# Altium project SteeringWheelSTM32F4.PrjPcb
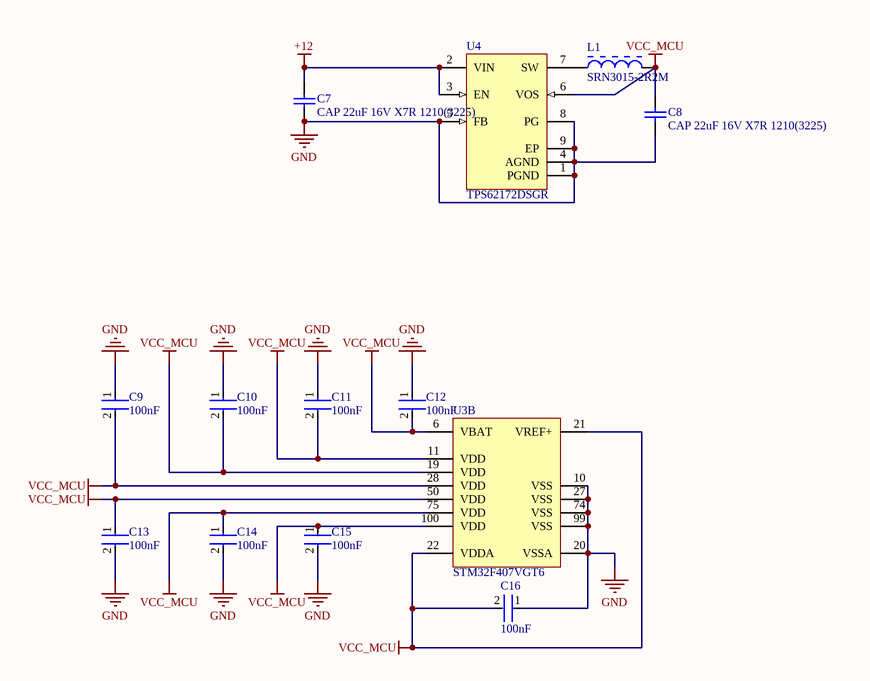
[diagram p0: Power_Supply.SchDoc]
5 sheets, 36 parts. Net scope: flat (ports and power ports of the same name join across sheets).
Board file: SteeringWheelSTM32F4.PcbDoc
Sheets:
  Power_Supply.SchDoc
  Connector.SchDoc
  MCU.SchDoc
  Communications.SchDoc
  User_LEDs.SchDoc

## Sheet Power_Supply.SchDoc
size Letter; Organization: Altium Limited; Address1: L3, 12a Rodborough Rd; Address2: Frenchs Forest; Address3: NSW; Address4: Australia 2086

### Parts
C7  CAP 22uF 16V X7R 1210(3225)  [CAPC1210(3225)280_L]
C8  CAP 22uF 16V X7R 1210(3225)  [CAPC1210(3225)280_L]
C9  100nF  [Kemet_C0603_IPC_A]
C10  100nF  [Kemet_C0603_IPC_A]
C11  100nF  [Kemet_C0603_IPC_A]
C12  100nF  [Kemet_C0603_IPC_A]
C13  100nF  [Kemet_C0603_IPC_A]
C14  100nF  [Kemet_C0603_IPC_A]
C15  100nF  [Kemet_C0603_IPC_A]
C16  100nF  [Kemet_C0603_IPC_A]
L1  SRN3015-2R2M  [BOUR-SRN3015-2_V]
U3  STM32F407VGT6  [STM-LQFP100_M]  (part B of 2)
U4  TPS62172DSGR  [DSG8-1600X900TP]

### Nets
+12: C7.2 U4.2(VIN) U4.3(EN)
GND: C7.1 C8.1 C9.1 C10.1 C11.1 C12.1 C13.2 C14.2 C15.2 C16.1 U3.10(VSS) U3.20(VSSA) U3.27(VSS) U3.74(VSS) U3.99(VSS) U4.1(PGND) U4.4(AGND) U4.5(FB) U4.8(PG) U4.9(EP)
VCC_MCU: C8.2 C9.2 C10.2 C11.2 C12.2 C13.1 C14.1 C15.1 C16.2 L1.2 U3.6(VBAT) U3.11(VDD) U3.19(VDD) U3.21(VREF+) U3.22(VDDA) U3.28(VDD) U3.50(VDD) U3.75(VDD) U3.100(VDD) U4.6(VOS)
NetL1_1: L1.1 U4.7(SW)

### Notes on the sheet
- Title
- Size:
- Date:
- Letter
- Number:
- Time:
- Revision:
- Sheet
- of
- File:

### Library data of the parts
C7 C8 = CMP-1038-02277-1: CAP 22uF 16V ±10% 1210 (3225 Metric) Thickness 2.8mm SMD; Case-Metric: 3225; Case-EIA: 1210; Tolerance: Â±10%; Rated Voltage: 16 V; Technology: SMT; Value: 22uF; Max Thickness: 2.8 mm
C9-C16 = C0603C104K5RACTU: CAP CER 0.1UF 100NF 50V X7R 0603 C0603C104K5RACTU
L1 = CMP-0007-00003-1: Semi-shielded Power Inductor, 2.2 uH, +/- 20%, 1.8 A, -40 to 125 degC, 3 x 3 x 1.5 mm SMD, RoHS and Halogen Free, Tape and Reel; Manufacturer: Bourns; Isat: 1.65 A; Rated current: 1.8 A; Inductance: 2.2 uH; Inductance tolerance: +/- 20%; DCR Max: 0.072 Ohm; SRF Min: 90 MHz; Resistance to Solder Heat: +260 degC for 10 sec.; Operating Temperature: -40 to 125 degC; PartNumber: SRN3015-2R2M; Packing: Tape and Reel; ComponentLink3Description: Package Specification; ComponentLink2Description: Datasheet; RoHS: TRUE; ComponentLink3URL: http://www.bourns.com/data/global/pdfs/SRN3015.pdf; PackageDescription: 2-Pin SMD, Body 3 x 3 mm, Height 1.5 mm; ComponentLink1URL: http://www.bourns.com/; ComponentLink1Description: Manufacturer URL; DatasheetVersion: Aug-11; Mounting Technology: Surface Mount; ComponentLink2URL: http://www.bourns.com/data/global/pdfs/SRN3015.pdf; PackageReference: SRN3015
U3 = CMP-0243-00017-3: ARM Cortex-M4 32-bit MCU+FPU, 210 DMIPS, 1024 kB Flash, 192 kB Internal RAM, 82 I/Os, 100-pin LQFP, -40 to 85 degC, Tray; Manufacturer: STMicroelectronics; Supply Voltage(Vcc) min (V): 1.8; Supply Voltage(Vcc) max (V): 3.6; I/Os (High Current): 82; Operating Frequency(F) (Processor speed) (MHz): 168; D/A Converter: 2x12-bit; FLASH Size (Prog) (kB): 1024; Internal RAM Size (kB): 192; PackageDescription: 100-Pin Low Profile Quad Flat Package, 14 x 14 mm Body, 0.5 mm Pitch; ComponentLink3URL: http://www.st.com/st-web-ui/static/active/en/resource/technical/document/data_brief/DM00071938.pdf; PackageVersion: Rev. 1, 06/2013; PackageReference: LQFP100; PartNumber: STM32F407VGT6; ComponentLink1Description: Manufacturer URL; ComponentLink2URL: http://www.st.com/st-web-ui/static/active/en/resource/technical/document/datasheet/DM00037051.pdf; DatasheetVersion: Rev. 4; ComponentLink3Description: Package Specification; Core: ARM Cortex-M4; ComponentLink2Description: Datasheet; Mounting Technology: Surface Mount; ComponentLink1URL: http://www.st.com/web/en/home.html; Packing: Tray
U4 = TPS62172DSGR: Buck Step Down Regulator with 3 to 17 V Input and 3.3 V Output, -40 to 85 degC, 8-Pin WSON (DSG), Green (RoHS & no Sb/Br); Manufacturer: Texas Instruments; Vout(Min)(V): 3.3; Vin(Min)(V): 3; Duty Cycle(Max)(%): 100; SubFamily: Step-Down Regulator; Iq(Typ)(mA): 0.017; Vin(Max)(V): 17; Synchronous Rectification: TRUE; Regulated Outputs(#): 1; Rating: Catalog; Switch Current Limit(Typ)(A): 1.05; Iout(Max)(A): 0.5; Vout(Max)(V): 3.3; Preset Vout(V): 3.3; Topology: Buck; Eco-Plan: Green (RoHS & no Sb/Br); PartNumber: TPS62172DSGR; ComponentLink1Description: Datasheet; ComponentLink2Description: Package Specification; DatasheetVersion: SLVSAT8A; ComponentLink3URL: Samples URL:http://www.ti.com/product/tps62172#samples; ComponentLink1URL: http://www.ti.com/general/docs/lit/getliterature.tsp?genericPartNumber=TPS62172&fileType=pdf; Code_JEDEC: MO-229; ComponentLink2URL: http://www.ti.com/litv/pdf/mpds308a; ComponentLink3Description: URL Link1; PackageVersion: revB, Oct-2010; Mounting Technology: Surface Mount; PackageReference: DSG8-1600X900TP; PackageDescription: 8-Pin Plastic Small Outline No-Lead, 2 x 2 x 0.8 mm Body, 0.5 mm Pitch, Exposed Pad

## Sheet Connector.SchDoc
size A4
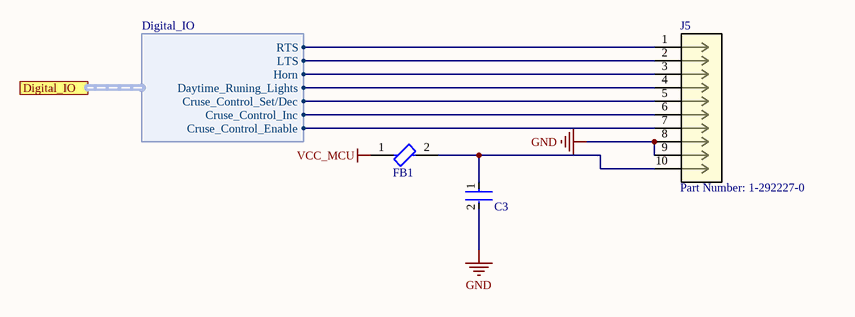
[diagram p1: Connector.SchDoc]

### Parts
C3  C0603C104K5RACTU  [Kemet_C0603_IPC_A]  (value not drawn)
FB1  2508056017Y2  [Fair-Rite_250805_0]  (value not drawn)
J5  Part Number: 1-292227-0  [CON10_1X10_DRH_H]

### Ports
Digital_IO (harness Digital_IO)

### Harnesses
Digital_IO: Cruse_Control_Enable, Cruse_Control_Inc, Cruse_Control_Set/Dec, Daytime_Runing_Lights, Horn, LTS, RTS

### Nets
GND: C3.2 J5.8 J5.9
VCC_MCU: FB1.1
NetC3_1: C3.1 FB1.2 J5.10
NetJ5_1: J5.1 ; port Digital_IO.RTS
NetJ5_2: J5.2 ; port Digital_IO.LTS
NetJ5_3: J5.3 ; port Digital_IO.Horn
NetJ5_4: J5.4 ; port Digital_IO.Daytime_Runing_Lights
NetJ5_5: J5.5 ; port Digital_IO.Cruse_Control_Set/Dec
NetJ5_6: J5.6 ; port Digital_IO.Cruse_Control_Inc
NetJ5_7: J5.7 ; port Digital_IO.Cruse_Control_Enable

### Library data of the parts
J5 = 1-292227-0: No Description Available; Vendor: TE Connectivity; Built_By: EMA_UL_Team; Manufacturer_Part_Number: 1-292227-0; Copyright: Copyright (C) 2018 Accelerated Designs. All rights reserved; RefDes: RefDes; Type: DEV; Value: Value

## Sheet MCU.SchDoc
size A4; Organization: Altium Limited; Address1: L3, 12a Rodborough Rd; Address2: Frenchs Forest; Address3: NSW; Address4: Australia 2086
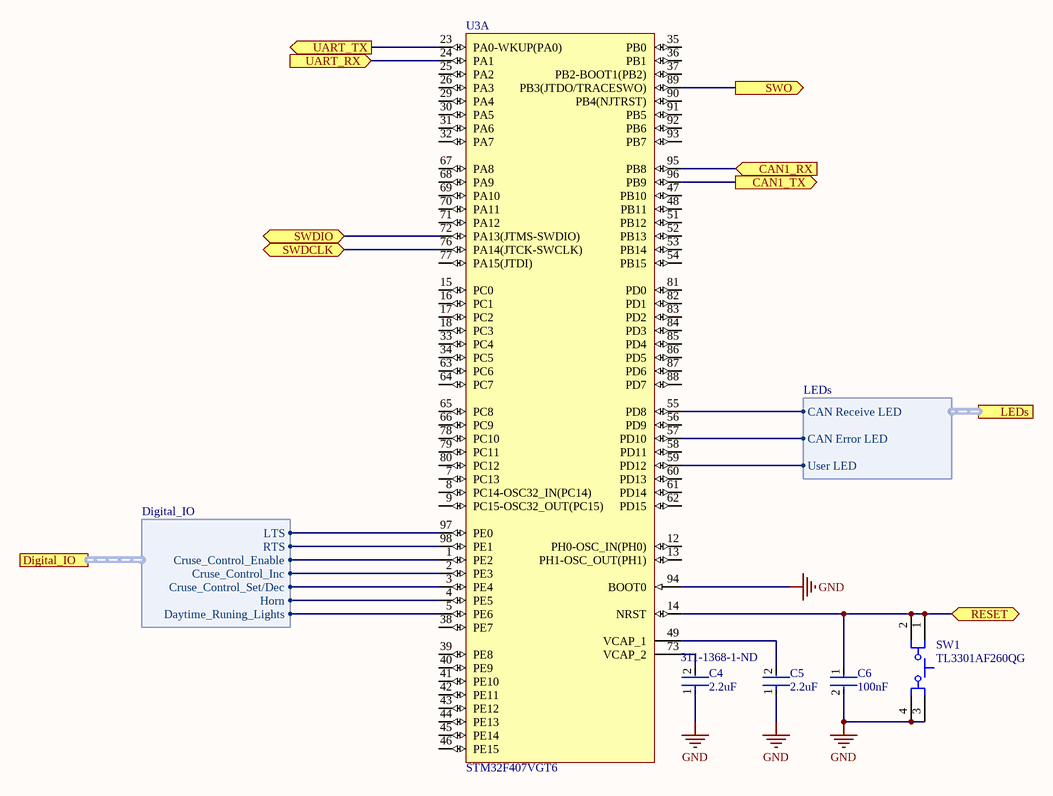
[diagram p2: MCU.SchDoc]

### Parts
C4  2.2uF  Supplier Part Number 1: 311-1368-1-ND  [Yageo_CC0805-0.85_IPC_A]
C5  2.2uF  [Yageo_CC0805-0.85_IPC_A]
C6  100nF  [Kemet_C0603_IPC_A]
SW1  TL3301AF260QG  [ESWI-TL3301AF260QG_V]
U3  STM32F407VGT6  [STM-LQFP100_M]  (part A of 2)

### Ports
CAN1_RX (in), CAN1_TX (out), Digital_IO (harness Digital_IO), LEDs (harness LEDs), RESET (bidir), SWDCLK (bidir), SWDIO (bidir), SWO (out), UART_RX (in), UART_TX (out)

### Harnesses
LEDs: CAN Error LED, CAN Receive LED, User LED
Digital_IO: LTS, RTS, Cruse_Control_Enable, Cruse_Control_Inc, Cruse_Control_Set/Dec, Horn, Daytime_Runing_Lights

### Nets
GND: C4.1 C5.1 C6.2 SW1.3 SW1.4 U3.94(BOOT0)
NetC4_2: C4.2 U3.73(VCAP_2)
NetC5_2: C5.2 U3.49(VCAP_1)
NetC6_1: C6.1 SW1.1 SW1.2 U3.14(NRST) ; port RESET
NetH3_1: U3.23(PA0-WKUP(PA0)) ; port UART_TX
NetH3_2: U3.24(PA1) ; port UART_RX
NetJ1_4: U3.72(PA13(JTMS-SWDIO)) ; port SWDIO
NetJ1_6: U3.76(PA14(JTCK-SWCLK)) ; port SWDCLK
NetJ1_8: U3.89(PB3(JTDO/TRACESWO)) ; port SWO
NetJ5_1: U3.98(PE1) ; port Digital_IO.RTS
NetJ5_2: U3.97(PE0) ; port Digital_IO.LTS
NetJ5_3: U3.4(PE5) ; port Digital_IO.Horn
NetJ5_4: U3.5(PE6) ; port Digital_IO.Daytime_Runing_Lights
NetJ5_5: U3.3(PE4) ; port Digital_IO.Cruse_Control_Set/Dec
NetJ5_6: U3.2(PE3) ; port Digital_IO.Cruse_Control_Inc
NetJ5_7: U3.1(PE2) ; port Digital_IO.Cruse_Control_Enable
NetR5_2: U3.55(PD8) ; port LEDs.CAN Receive LED
NetR6_2: U3.57(PD10) ; port LEDs.CAN Error LED
NetR7_2: U3.59(PD12) ; port LEDs.User LED
NetU1_1: U3.96(PB9) ; port CAN1_TX
NetU1_4: U3.95(PB8) ; port CAN1_RX

Not connected (* = marked no-connect by the designer): U3 7(PC13) 8(PC14-OSC32_IN(PC14)) 9(PC15-OSC32_OUT(PC15)) 12(PH0-OSC_IN(PH0)) 13(PH1-OSC_OUT(PH1)) 15(PC0) 16(PC1) 17(PC2) 18(PC3) 25(PA2) 26(PA3) 29(PA4) 30(PA5) 31(PA6) 32(PA7) 33(PC4) 34(PC5) 35(PB0) 36(PB1) 37(PB2-BOOT1(PB2)) 38(PE7) 39(PE8) 40(PE9) 41(PE10) 42(PE11) 43(PE12) 44(PE13) 45(PE14) 46(PE15) 47(PB10) 48(PB11) 51(PB12) 52(PB13) 53(PB14) 54(PB15) 56(PD9) 58(PD11) 60(PD13) 61(PD14) 62(PD15) 63(PC6) 64(PC7) 65(PC8) 66(PC9) 67(PA8) 68(PA9) 69(PA10) 70(PA11) 71(PA12) 77(PA15(JTDI)) 78(PC10) 79(PC11) 80(PC12) 81(PD0) 82(PD1) 83(PD2) 84(PD3) 85(PD4) 86(PD5) 87(PD6) 88(PD7) 90(PB4(NJTRST)) 91(PB5) 92(PB6) 93(PB7)

### Notes on the sheet
- Title
- Size:
- Date:
- A4
- Number:
- Time:
- Revision:
- Sheet
- of
- File:

### Library data of the parts
C4 = CC0805KKX7R6BB225: 2.2UF CC0805KKX7R6BB225; Manufacturer 1: Yageo; Dielectric Material: Ceramic; Tolerance: 10%; Dielectric: X7R; Voltage Rating: 10V; Supplier 1: Digi-Key; Manufacturer Part Number 1: CC0805KKX7R6BB225; Stock 1: 101677; Pricing 1: 1=0.25000, 10=0.17200, 100=0.09760, 500=0.06890, 1000=0.06029 (USD); RoHS: Yes; Mount: Surface Mount; Case/Package: 0805; Weight: 0.000194oz; Case Code (Metric): 2012; Case Code (Imperial): 0805; Min Operating Temperature: -55°C; Max Operating Temperature: 125°C; Capacitance: 2.2uF; Voltage Rating (DC): 10V; Packaging: Tape and Reel; Package Quantity: 1; Termination: SMD/SMT; Composition: Ceramic; Length: 2mm; Height: 1.25mm; Width: 0.049inch; Thickness: 0.049inch; Depth: 1.25mm; Radiation Hardening: No; REACH SVHC: Unknown; Lead Free: Lead Free; Halogen Free: Halogen Free; ComponentLink1URL: https://datasheet.ciiva.com/5789/1734573-5789888.pdf?src-supplier=Farnell; ComponentLink1Description: https://datasheet.ciiva.com/5789/1734573-5789888.pdf?src-supplier=Farnell; ComponentLink2URL: https://datasheet.ciiva.com/161/mlccorderingcode-161925.pdf?src-supplier=Digi-Key; ComponentLink2Description: https://datasheet.ciiva.com/161/mlccorderingcode-161925.pdf?src-supplier=Digi-Key; ComponentLink3URL: https://datasheet.ciiva.com/15189/getdatasheetpartid-315916-15189205.pdf?src-supplier=Verical; ComponentLink3Description: https://datasheet.ciiva.com/15189/getdatasheetpartid-315916-15189205.pdf?src-supplier=Verical; ComponentLink4URL: https://datasheet.ciiva.com/161/mlccorderingcode-161926.pdf?src-supplier=Digi-Key; ComponentLink4Description: https://datasheet.ciiva.com/161/mlccorderingcode-161926.pdf?src-supplier=Digi-Key; ComponentLink5URL: https://datasheet.ciiva.com/161/mlccorderingcode-161927.pdf?src-supplier=Digi-Key; ComponentLink5Description: https://datasheet.ciiva.com/161/mlccorderingcode-161927.pdf?src-supplier=Digi-Key; ComponentLink6URL: https://datasheet.ciiva.com/8033/70765-8033975.pdf?src-supplier=Element14; ComponentLink6Description: https://datasheet.ciiva.com/8033/70765-8033975.pdf?src-supplier=Element14; ComponentLink7URL: https://datasheet.ciiva.com/8033/1734573-8033977.pdf?src-supplier=Element14; ComponentLink7Description: https://datasheet.ciiva.com/8033/1734573-8033977.pdf?src-supplier=Element14; ComponentLink8URL: https://datasheet.ciiva.com/13208/upy-gphc-x7r-6-3v-to-50v-8-12304-13208665.pdf?src-supplier=Mouser; ComponentLink8Description: https://datasheet.ciiva.com/13208/upy-gphc-x7r-6-3v-to-50v-8-12304-13208665.pdf?src-supplier=Mouser; ComponentLink9URL: https://datasheet.ciiva.com/8033/1734573-8033979.pdf?src-supplier=Element14; ComponentLink9Description: https://datasheet.ciiva.com/8033/1734573-8033979.pdf?src-supplier=Element14; ComponentLink10URL: https://datasheet.ciiva.com/16624/upy-gphc-x7r-6-3v-to-50v-8-16624651.pdf?src-supplier=Avnet+Europe; ComponentLink10Description: https://datasheet.ciiva.com/16624/upy-gphc-x7r-6-3v-to-50v-8-16624651.pdf?src-supplier=Avnet+Europe; ComponentLink11URL: https://datasheet.ciiva.com/11587/upy-gphc-x7r-6-3v-to-50v-8-11587213.pdf?src-supplier=Avnet; ComponentLink11Description: https://datasheet.ciiva.com/11587/upy-gphc-x7r-6-3v-to-50v-8-11587213.pdf?src-supplier=Avnet
C5 = CC0805KKX7R6BB225: 2.2UF CC0805KKX7R6BB225
C6 = C0603C104K5RACTU: as C9 on sheet Power_Supply
SW1 = CMP-2000-07249-1: Tactile Switch, SPST-NO, 50 mA, 12 V, -20 to 70 degC, 4-Pin SMD, RoHS, Tape and Reel; Manufacturer: E-Switch; Catalog Drawings: TL3301xFFootprint; Contact Rating @ Voltage: 0.05A@12VDC; Featured Product: TL3301SeriesTactSwitch; Mechanical Life: 100,000Cycles; Product Training Modules: SwitchBasics; Actuator Orientation: TopActuated; Switch Travel: 0.25mm; Other Names: EG2527DKR; 3D Model: TL3301AFyyyyG.stp; Illumination: Non-Illuminated; Switch Function: Off-Mom; Online Catalog: TL3301Series; Outline: 6.00mmx6.00mm; Package Version: Rev. D, 10/2014; Operating Force: 260gf; Actuator Material: Polyamide(PA),Nylon; Actuator Type: Standard; Actuator Height off PCB, from Pins: 5.00mm; Packaging: Digi-Reel®; Standard Package: 1; Datasheet URL: https://www.e-switch.com/system/asset/product_line/data_sheet/185/TL3301.pdf; Family: TactileSwitches; Mounting Technology: SurfaceMount; Illumination Type, Color: -; Manufacturer URL: http://www.e-switch.ch/en/; RoHS Information: TL3301SeriesRoHSCertofCompliance; Ingress Protection: -; Package URL: http://spec_sheets.e-switch.com/specs/P010513.pdf; Illumination Voltage (Nominal): -; Operating Temperature: -20°C~70°C; Series: TL3301; Termination Style: GullWing; Category: Switches; Mounting Type: SurfaceMount; Package Description: 4-Pin Surface Mount Device, Body 6 x 6 mm; Features: -; Circuit: SPST-NO; Package Reference: TL3301AF260QG; Datasheet Version: 12/2013
U3 = CMP-0243-00017-3: as U3 on sheet Power_Supply; PackageDescription: 100-Pin Low Profile Quad Flat Package, 14 x 14 mm Body, 0.5 mm Pitch; ComponentLink3URL: http://www.st.com/st-web-ui/static/active/en/resource/technical/document/data_brief/DM00071938.pdf; PackageVersion: Rev. 1, 06/2013; PackageReference: LQFP100; PartNumber: STM32F407VGT6; ComponentLink1Description: Manufacturer URL; ComponentLink2URL: http://www.st.com/st-web-ui/static/active/en/resource/technical/document/datasheet/DM00037051.pdf; DatasheetVersion: Rev. 4; ComponentLink3Description: Package Specification; Core: ARM Cortex-M4; ComponentLink2Description: Datasheet; Mounting Technology: Surface Mount; ComponentLink1URL: http://www.st.com/web/en/home.html; Packing: Tray

## Sheet Communications.SchDoc
size A; Organization: Altium Limited; Address1: L3, 12a Rodborough Rd; Address2: Frenchs Forest; Address3: NSW; Address4: Australia 2086
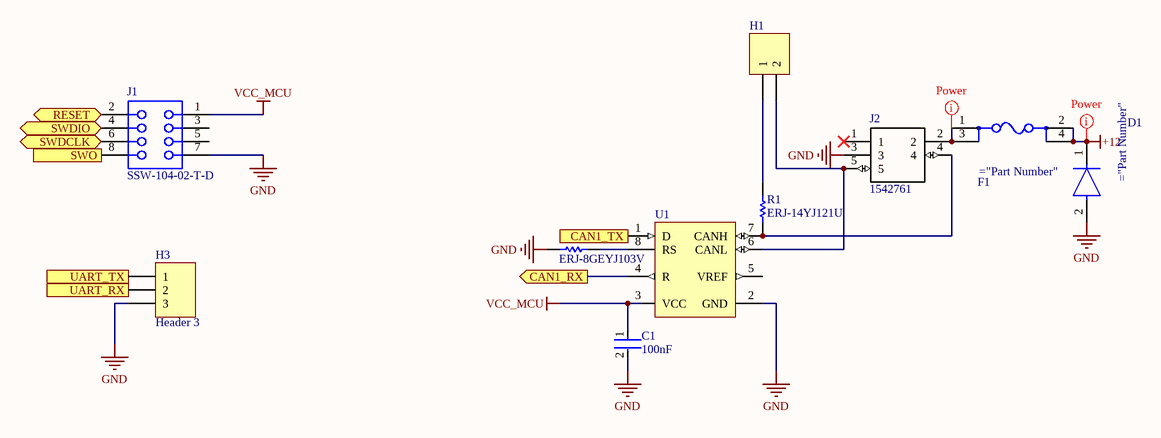
[diagram p3: Communications.SchDoc]

### Parts
C1  100nF  [Kemet_C0603_IPC_A]
D1  S1J-13-F  [Diodes_SMA_0]  (value not drawn)
F1  3557-2  [Keystone_3557-2_0]  (value not drawn)
H1  Header 0  [HDR1X2]  (value not drawn)
H3  Header 3  [HDR1X3]
J1  SSW-104-02-T-D  [SMTC-SSW-104-02-X-D]
J2  1542761  [1542761]
R1  ERJ-14YJ121U  [RESC3225X70X50ML20T20]
R2  ERJ-8GEYJ103V  [RESC3216X70X50NL05T20]
U1  SN65HVD230D  [D0008A_M]  (value not drawn)

### Ports
CAN1_RX (out), CAN1_TX (in), RESET (bidir), SWDCLK (bidir), SWDIO (bidir), SWO (out), UART_RX (out), UART_TX (in)

### Nets
+12: D1.1(C) F1.2 F1.4
GND: C1.2 D1.2(A) H3.3 J1.7 J2.3 R2.2 U1.2(GND)
VCC_MCU: C1.1 J1.1 U1.3(VCC)
NetC6_1: J1.2 ; port RESET
NetF1_1: F1.1 F1.3 J2.2
NetH1_1: H1.1 R1.2
NetH1_2: H1.2 J2.5 U1.6(CANL)
NetH3_1: H3.1 ; port UART_TX
NetH3_2: H3.2 ; port UART_RX
NetJ1_4: J1.4 ; port SWDIO
NetJ1_6: J1.6 ; port SWDCLK
NetJ1_8: J1.8 ; port SWO
NetJ2_4: J2.4 R1.1 U1.7(CANH)
NetR2_1: R2.1 U1.8(RS)
NetU1_1: U1.1(D) ; port CAN1_TX
NetU1_4: U1.4(R) ; port CAN1_RX

Not connected (* = marked no-connect by the designer): J1 3 5; J2 1*; U1 5(VREF)

### Layout directives
net class Power: +12, NetF1_1

### Notes on the sheet
- Title
- Size:
- Date:
- A
- Number:
- Time:
- Revision:
- Sheet
- of
- File:

### Library data of the parts
C1 = C0603C104K5RACTU: as C9 on sheet Power_Supply
H1 = Header 2: Header, 2-Pin; LatestRevisionDate: 17-Jul-2002; LatestRevisionNote: Re-released for DXP Platform.; Publisher: Altium Limited
H3 = Header 3: Header, 3-Pin; LatestRevisionDate: 17-Jul-2002; LatestRevisionNote: Re-released for DXP Platform.; Publisher: Altium Limited
J1 = CMP-1023-00342-1: SQ Post Socket, Through-hole, Vertical, -55 to 105 degC, 2.54mm Pitch, 8-Pin, Female, RoHS; Manufacturer: Samtec; Mounting Technology: Through-hole; ComponentLink3Description: Package Specification; ComponentLink3URL: http://www.samtec.com/documents/webfiles/cpdf/SSW-1XX-XX-XXX-X-XX-XXX-XX-MKT.pdf; Temperature Range: -55 to 105 degC; DatasheetVersion: F-214; PackageVersion: CA, 6/1987; ComponentLink1URL: http://www.samtec.com; RoHS: True; Pitch: 2.54 mm; ComponentLink2Description: Datasheet; ComponentLink2URL: http://www.samtec.com/documents/webfiles/pdf/SSW_TH.PDF; PackageDescription: Assembly, Socket Strip .016 X .031 Tail; PackageReference: SSW-104-02-X-D; ComponentLink1Description: Manufacturer URL; PartNumber: SSW-104-02-T-D; Orientation: Vertical
J2 = 1542761: Connector; Manufacturer_Name: Phoenix Contact; Allied_Number: 70170366; Datasheet Link: https://media.digikey.com/PDF/Data%20Sheets/Phoenix%20Contact%20PDFs/1542761.pdf; Height: 18mm; Manufacturer_Part_Number: 1542761; Mouser Part Number: 651-1542761; Mouser Price/Stock: https://www.mouser.com/Search/Refine.aspx?Keyword=651-1542761; RS Part Number: 8025583; RS Price/Stock: http://uk.rs-online.com/web/p/products/8025583; Allied Price/Stock: https://www.alliedelec.com/phoenixcontact-1542761/70170366/
R1 = CMP-2005-03490-1: 120Ohm; Manufacturer: Panasonic; Part Number: ERJ-14YJ121U
R2 = CMP-2003-00545-1: 10k; Manufacturer: Panasonic; Part Number: ERJ-8GEYJ103V
U1 = CMP-0315-00046-3: CAN Bus Transceiver, 3.3 V, -40 to 85 degC, 8-Pin SOIC (D), Green (RoHS & no Sb/Br), Tube; Supply Voltage Min: 3 V; Supply Voltage Max: 3.6 V; PartNumber: SN65HVD230D; ComponentLink2URL: http://www.ti.com/general/docs/lit/getliterature.tsp?genericGeneric Part Number=SN65HVD230&fileType=pdf; DatasheetVersion: SLOS346N; Generic Part Number: SN65HVD230; Packing: Tube; Temperature Min: -40 degC; Temperature Max: 85 degC; ComponentLink1Description: Manufacturer URL; Mounting Technology: Surface Mount; RoHS: TRUE; ComponentLink1URL: http://www.ti.com/; ComponentLink2Description: Datasheet; PackageDescription: 8-Pin Plastic Small Outline, Body 4.9 x 3.9 mm, Pitch 1.27 mm

## Sheet User_LEDs.SchDoc
size A; Organization: Altium Limited; Address1: L3, 12a Rodborough Rd; Address2: Frenchs Forest; Address3: NSW; Address4: Australia 2086
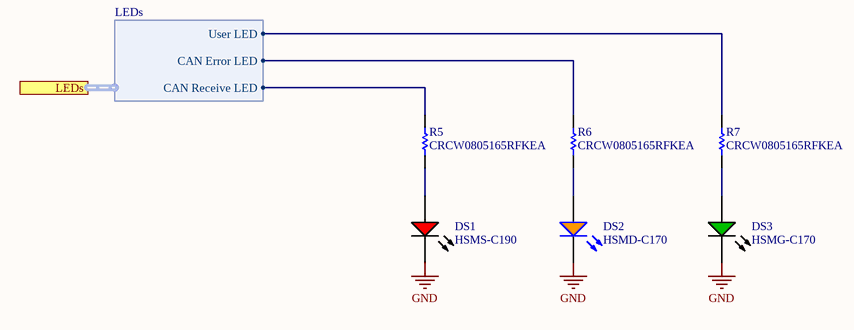
[diagram p4: User_LEDs.SchDoc]

### Parts
DS1  HSMS-C190  [AVAG-HSMX-C190_V]
DS2  HSMD-C170  [AVAG-HSMX-C170_V]
DS3  HSMG-C170  [AVAG-HSMX-C170_V]
R5  CRCW0805165RFKEA  [RESC2013X50X30ML20T20]
R6  CRCW0805165RFKEA  [RESC2013X50X30ML20T20]
R7  CRCW0805165RFKEA  [RESC2013X50X30ML20T20]

### Ports
LEDs (harness LEDs)

### Harnesses
LEDs: CAN Error LED, CAN Receive LED, User LED

### Nets
GND: DS1.2(K) DS2.2(K) DS3.2(K)
NetDS1_1: DS1.1(A) R5.1
NetDS2_1: DS2.1(A) R6.1
NetDS3_1: DS3.1(A) R7.1
NetR5_2: R5.2 ; port LEDs.CAN Receive LED
NetR6_2: R6.2 ; port LEDs.CAN Error LED
NetR7_2: R7.2 ; port LEDs.User LED

### Notes on the sheet
- Title
- Size:
- Date:
- A
- Number:
- Time:
- Revision:
- Sheet
- of
- File:

### Library data of the parts
DS1 = CMP-2000-06427-1: LED Uni-Color Red, 52 mW, 20 mA, -40 to 85 degC, 2-Pin SMD, RoHS, Tape and Reel; Manufacturer: Avago; Reverse Voltage: 5V; Viewing Angle: 170deg; High Brightness: No; Lens Type: ColorlessDiffused; DELETED: Compliant; Product Height (mm): 0.8mm; Dominant Wave Length: 626nm; Number of  Elements: 1; Chip Material: GaP; Lum Intensity: 10mcd; Product Length (mm): 1.6mm; Forward Voltage: 2.6V; Power Dissipation: 52W; Shape Type: Rectangular; Forward Current: 25mA; Peak Wavelength: 630nm; Test Current (It): 20mA; Main Category: ChipLED; Lens Dimensions: 1x0.8x0.5mm; Pin Count: 2; Package Reference: HSMX-C190; Mounting Technology: SurfaceMount; Mounting: SurfaceMount; Datasheet URL: http://docs.avagotech.com/docs/AV02-0551EN; Package Type: ChipLed; Operating Temperature Classification: Industrial; Datasheet Version: 03/2012; Operating Temp Range: -40Cto85C; Emitting Color: Red; Rad Hardened: No; Manufacturer URL: http://www.avagotech.com/; Luminous Intensity: 10mcd; Package Description: 2-Pin Surface Mount Device, Body 1.6 x 0.8 mm, Height 0.9 mm; Type: Uni-Color; Packaging: TapeandReel; Product Depth (mm): 0.8mm
DS2 = CMP-2000-06421-1: LED Uni-Color Orange, 52 mW, 20 mA, -40 to 85 degC, 2-Pin SMD, RoHS, Tape and Reel; Manufacturer: Avago; Forward Current If Max: 20mA; External Length / Height: 2mm; Luminous Intensity: 8mcd; Lens Shape: Rectangular; Bulb Size: 1.25mmx1.4mm; External Width: 1.25mm; Wavelength Typ: 605nm; Dominant Wavelength: 604nm; PIV Max: 5V; Opto Mounting Orientation: Top; Viewing Angle: 170°; LED Type: Standard; Forward Voltage: 2.2V; SVHC: NoSVHC(19-Dec-2012); No. of Pins: 2; External Depth: 0.8mm; Power Dissipation Pd: 52mW; Storage Temperature Max: 85°C; Package Description: 2-Pin Surface Mount Device, Body 2 x 1.25 mm, Height 0.8 mm; MSL: MSL2A-4weeks; Operating Temperature Range: -30°Cto+85°C; Datasheet URL: http://docs.avagotech.com/docs/AV02-0551EN; Manufacturer URL: http://www.avagotech.com/; Operating Temperature Min: -30°C; Light Area Height: 1.25mm; Mounting Technology: SurfaceMount; Storage Temperature Min: -40°C; LED Mounting: SMD; Peak Wavelength: 605nm; Package / Case: SMD; Peak Forward Current: 20mA; Forward Voltage VF Max: 2.2V; Mounting Type: SMD; LED Colour: Orange; Forward Current If: 20mA; Operating Temperature Max: 85°C; Voltage Vf Typ: 2.2V; Package Reference: HSMX-C170; Datasheet Version: 03/2012; Opto Case Style: SMD; Luminous Intensity Typ: 8mcd
DS3 = CMP-2000-05062-1: Chip LED, Green, 2.2 V, -40 to 85 degC, 2-Pin SMD, Pb-Free, Tape and Reel; Manufacturer: Avago; No. of Pins: 2; Peak Wavelength: 570nm; SVHC: NoSVHC(16-Jun-2014); Dominant Wavelength: 572nm; Forward Current If: 20mA; Viewing Angle: 170deg; Lens Shape: Rectangular; PIV Max: 5V; External Width: 1.25mm; LED Type: Standard; External Depth: 0.8mm; Opto Mounting Orientation: Top; Luminous Intensity: 15mcd; Luminous Intensity Min: 4mcd; Forward Voltage VF Max: 2.6V; External Length / Height: 2mm; Bulb Size: 1.25mmx1.4mm; Light Area Height: 1mm; Voltage Vf Typ: 2.2V; Operating Temperature Max: 85degC; Datasheet Version: Oct-08; MSL: MSL2A-4weeks; Peak Forward Current: 20mA; Package Description: 2-Pin Surface Mount Device, Body 2 x 1.25 mm, Height 0.8 mm; Datasheet URL: https://datasheet.ciiva.com/29280/180495-da-01-en-chip-led-hsmg-c170-gelb-gruen-29280971.pdf; Storage Temperature Min: -40degC; LED Colour: Green; Wavelength Typ: 570nm; Mounting Type: SMD; Forward Current If Max: 20mA; Dominant Wavelength Typ: 572nm; LED Mounting: SMD; Operating Temperature Range: -30degCto+85degC; Operating Temperature Min: -30degC; Manufacturer URL: http://www.avagotech.com/; Packaging: CutTape; Luminous Intensity Typ: 15mcd; Package Reference: HSMX-C170; Storage Temperature Max: 85degC; Opto Case Style: SMD; Forward Voltage: 2.2V
R5-R7 = CMP-2001-04978-1: Manufacturer: Vishay Dale; Part Number: CRCW0805165RFKEA

## Nets that join several sheets
+12: Power_Supply (C7.2 U4.2 U4.3), Communications (D1.1 F1.2 F1.4)
GND: Power_Supply (20 pins), Connector (C3.2 J5.8 J5.9), MCU (6 pins), Communications (7 pins), User_LEDs (DS1.2 DS2.2 DS3.2)
VCC_MCU: Power_Supply (20 pins), Connector (FB1.1), Communications (C1.1 J1.1 U1.3)
NetC6_1: MCU (C6.1 SW1.1 SW1.2 U3.14), Communications (J1.2)
NetH3_1: MCU (U3.23), Communications (H3.1)
NetH3_2: MCU (U3.24), Communications (H3.2)
NetJ1_4: MCU (U3.72), Communications (J1.4)
NetJ1_6: MCU (U3.76), Communications (J1.6)
NetJ1_8: MCU (U3.89), Communications (J1.8)
NetJ5_1: Connector (J5.1), MCU (U3.98)
NetJ5_2: Connector (J5.2), MCU (U3.97)
NetJ5_3: Connector (J5.3), MCU (U3.4)
NetJ5_4: Connector (J5.4), MCU (U3.5)
NetJ5_5: Connector (J5.5), MCU (U3.3)
NetJ5_6: Connector (J5.6), MCU (U3.2)
NetJ5_7: Connector (J5.7), MCU (U3.1)
NetR5_2: MCU (U3.55), User_LEDs (R5.2)
NetR6_2: MCU (U3.57), User_LEDs (R6.2)
NetR7_2: MCU (U3.59), User_LEDs (R7.2)
NetU1_1: MCU (U3.96), Communications (U1.1)
NetU1_4: MCU (U3.95), Communications (U1.4)